# Altium schematic sheet Ext_Components.SchDoc
size A; SheetNumber: 1; SheetTotal: 3
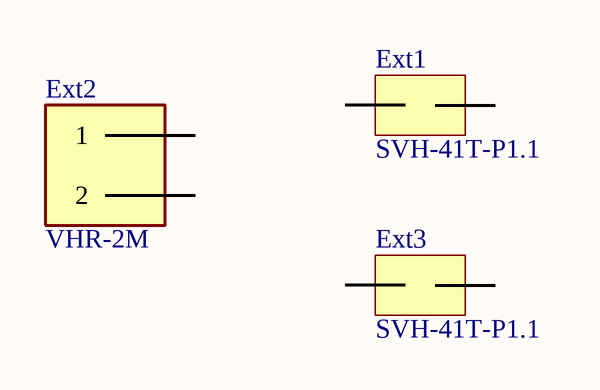
[diagram p0: Ext_Components.SchDoc]

## Parts
Ext1  SVH-41T-P1.1  [SVH-41T-P1.1-Footprint-1]
Ext2  VHR-2M  [VHR-2M-Footprint-1]
Ext3  SVH-41T-P1.1  [SVH-41T-P1.1-Footprint-1]

## Nets

Not connected (* = marked no-connect by the designer): Ext1 1 2; Ext2 1 2; Ext3 1 2

## Library data of the parts
Ext1 Ext3 = CMP-759-000002-2: 端子 适合20-16AWG(0.5-0.125mm²) 配:VH系列连接器 胶壳; Global PFAS Assessment Status: Not Affected; Green: Compliant; Rare Earth Element Information: Rare Earth Free; China RoHS Status: Unaffected; Design Item ID: CMP-002-00136-2; ELV: Compliant; EU SVHC List Version: Jan 23, 2024; Halogen Free: Compliant; Lead Free: Compliant; Persistent Organic Pollutants (POPs): Not Affected; REACH(SVHC) Information: Unaffected; RoHS Status: Yes; RoHS Version: 2011/65/EU, 2015/863; Source: Main.SCHLIB; TSCA: Compliant
Ext2 = CMP-002-00005-2: Conn Housing PL 2 POS 3.96mm Crimp ST Cable Mount Bag; China RoHS Status: Unaffected; Design Item ID: CMP-002-00135-3; ELV: Compliant; EU SVHC List Version: Oct 28, 2008; Lead Free: Compliant; REACH(SVHC) Information: Unknown; RoHS Status: Yes; RoHS Version: 2011/65/EU; Source: Main.SCHLIB